# EAGLE design cpu (EAGLE 6.4)
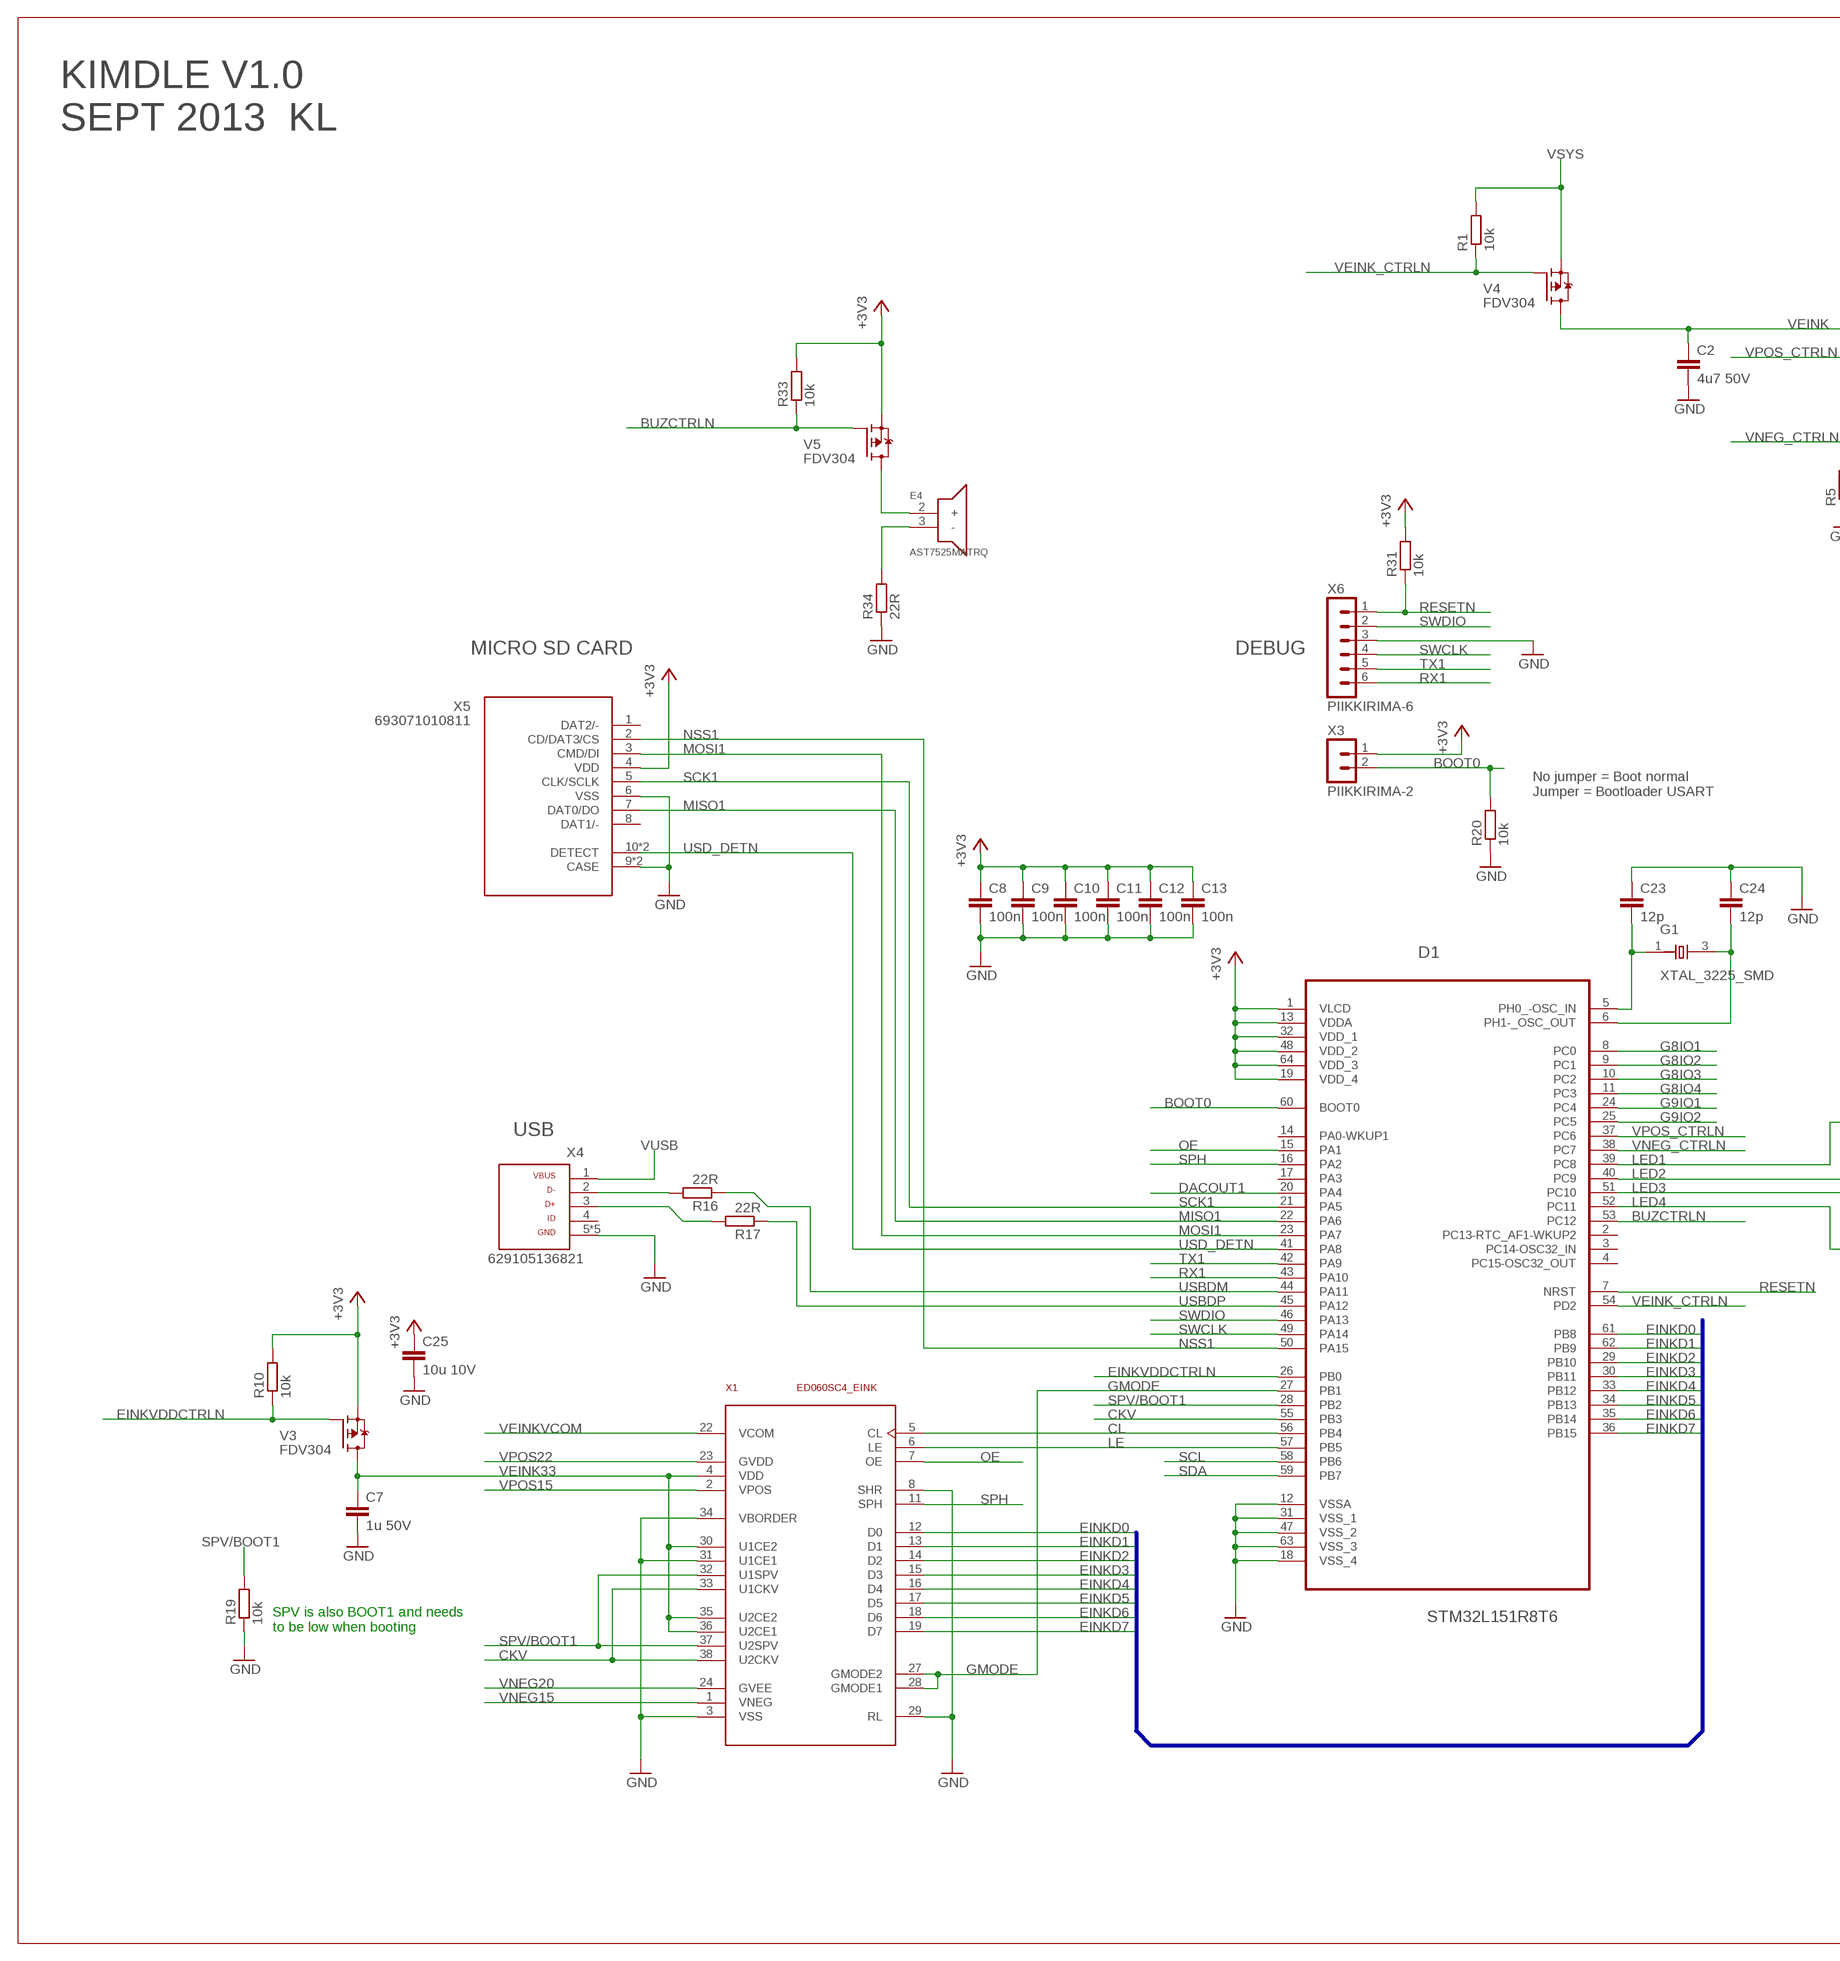
[diagram p0: schematic, sheet 1, part 1 of 2]
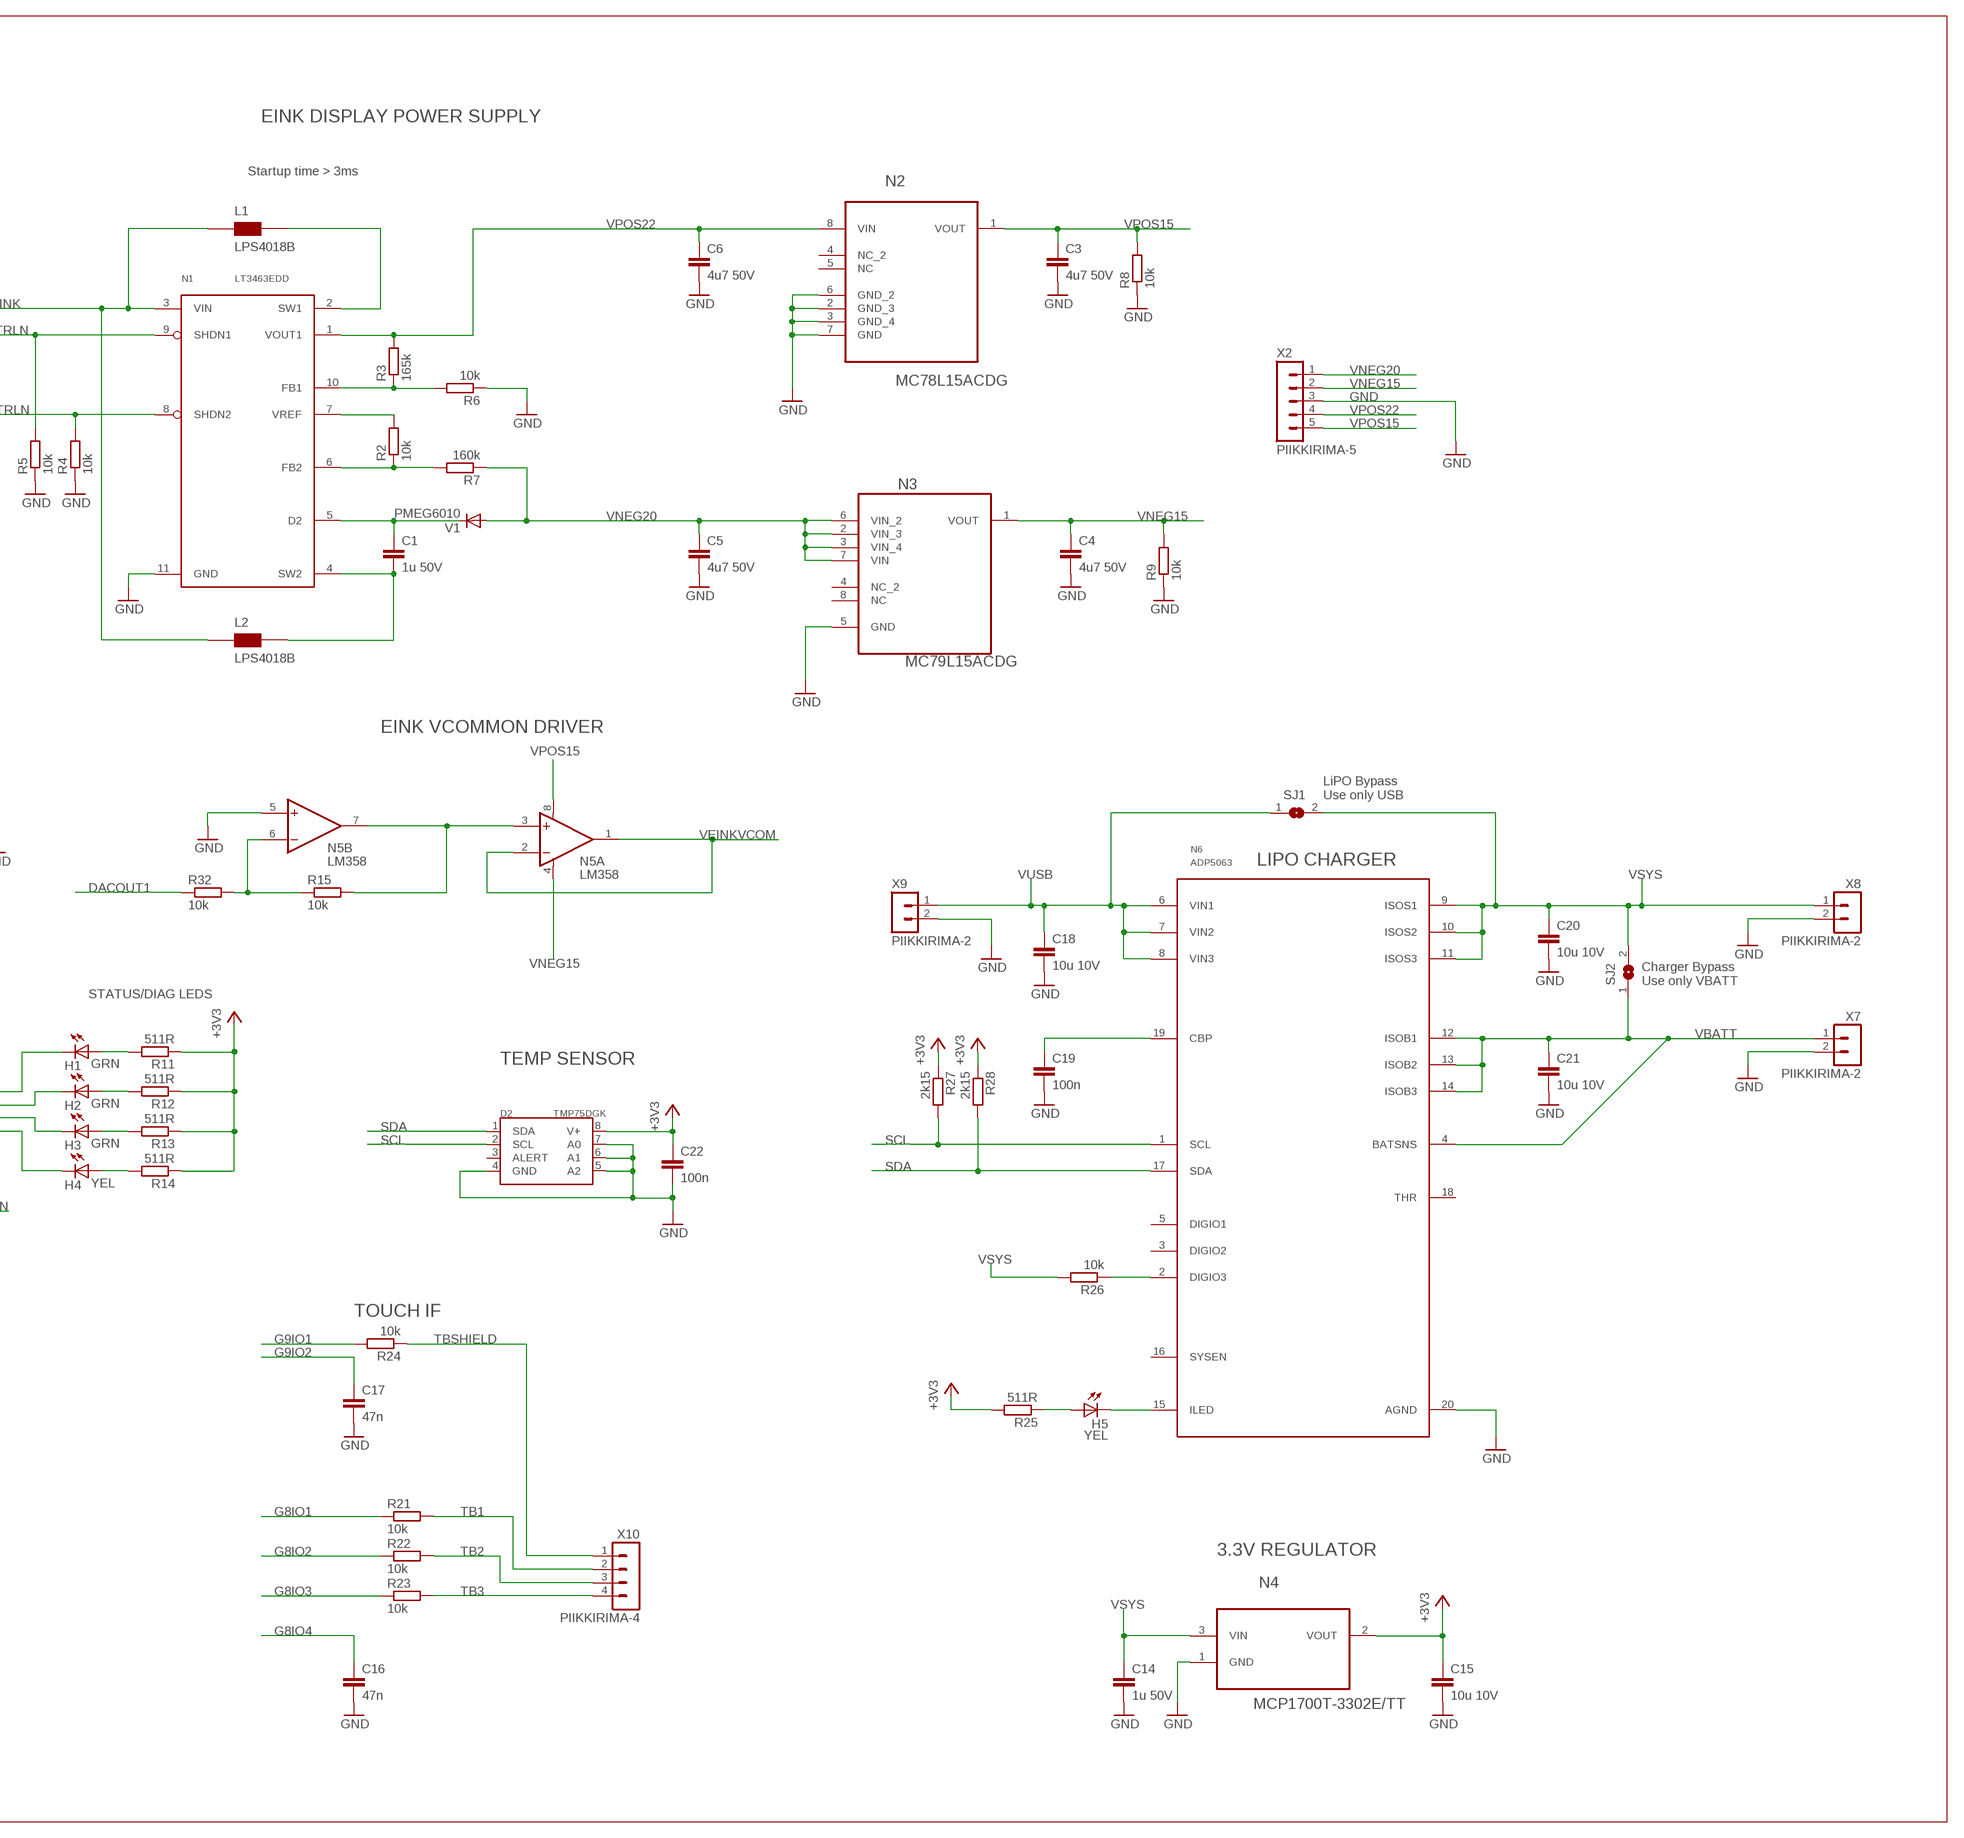
[diagram p1: schematic, sheet 1, part 2 of 2]

## Parts
C1  1u 50V  C-EUC0805  [C0805]
C2  4u7 50V  C-EUC0805  [C0805]
C3  4u7 50V  C-EUC0805  [C0805]
C4  4u7 50V  C-EUC0805  [C0805]
C5  4u7 50V  C-EUC0805  [C0805]
C6  4u7 50V  C-EUC0805  [C0805]
C7  1u 50V  C-EUC0805  [C0805]
C8  100n  C-EUC0603  [C0603]
C9  100n  C-EUC0603  [C0603]
C10  100n  C-EUC0603  [C0603]
C11  100n  C-EUC0603  [C0603]
C12  100n  C-EUC0603  [C0603]
C13  100n  C-EUC0603  [C0603]
C14  1u 50V  C-EUC0805  [C0805]
C15  10u 10V  C-EUC0805  [C0805]
C16  47n  C-EUC0805  [C0805]
C17  47n  C-EUC0805  [C0805]
C18  10u 10V  C-EUC0805  [C0805]
C19  100n  C-EUC0603  [C0603]
C20  10u 10V  C-EUC0805  [C0805]
C21  10u 10V  C-EUC0805  [C0805]
C22  100n  C-EUC0603  [C0603]
C23  12p  C-EUC0603  [C0603]
C24  12p  C-EUC0603  [C0603]
C25  10u 10V  C-EUC0805  [C0805]
D1  STM32L151R8T6  [QFP50P1200X1200X160-64N]
D2  TMP75DGK  [MSOP8]
E4  AST7525MATRQ  [AST7525MATRQ]
G1  XTAL_3225_SMD  [X_3225]
H1  GRN  LEDCHIP-LED0603  [CHIP-LED0603]
H2  GRN  LEDCHIP-LED0603  [CHIP-LED0603]
H3  GRN  LEDCHIP-LED0603  [CHIP-LED0603]
H4  YEL  LEDCHIP-LED0603  [CHIP-LED0603]
H5  YEL  LEDCHIP-LED0603  [CHIP-LED0603]
L1  LPS4018B  [LPS4018_V2]
L2  LPS4018B  [LPS4018_V2]
N1  LT3463EDD  [DFN300X300X80-11N]
N2  MC78L15ACDG  [SOIC127P600X175-8N]
N3  MC79L15ACDG  [SOIC127P600X175-8N]
N4  MCP1700T-3302E/TT  [SOT95P237X112-3N]
N5  LM358  MAX412CPAMSOP  [SOP65P490X110-8N]
N6  ADP5063  [QFN50P400X400X80-21N]
R1  10k  R-EU_R0603  [R0603]
R2  10k  R-EU_R0603  [R0603]
R3  165k  R-EU_R0603  [R0603]
R4  10k  R-EU_R0603  [R0603]
R5  10k  R-EU_R0603  [R0603]
R6  10k  R-EU_R0603  [R0603]
R7  160k  R-EU_R0603  [R0603]
R8  10k  R-EU_R0603  [R0603]
R9  10k  R-EU_R0603  [R0603]
R10  10k  R-EU_R0603  [R0603]
R11  511R  R-EU_R0603  [R0603]
R12  511R  R-EU_R0603  [R0603]
R13  511R  R-EU_R0603  [R0603]
R14  511R  R-EU_R0603  [R0603]
R15  10k  R-EU_R0603  [R0603]
R16  22R  R-EU_R0603  [R0603]
R17  22R  R-EU_R0603  [R0603]
R19  10k  R-EU_R0603  [R0603]
R20  10k  R-EU_R0603  [R0603]
R21  10k  R-EU_R0603  [R0603]
R22  10k  R-EU_R0603  [R0603]
R23  10k  R-EU_R0603  [R0603]
R24  10k  R-EU_R0603  [R0603]
R25  511R  R-EU_R0603  [R0603]
R26  10k  R-EU_R0603  [R0603]
R27  2k15  R-EU_R0603  [R0603]
R28  2k15  R-EU_R0603  [R0603]
R31  10k  R-EU_R0603  [R0603]
R32  10k  R-EU_R0603  [R0603]
R33  10k  R-EU_R0603  [R0603]
R34  22R  R-EU_R0603  [R0603]
SJ1  SJ  [SJ-SMALL]
SJ2  SJ  [SJ-SMALL]
V1  PMEG6010  DIODE-SOD323-R  [SOD323-R]
V3  FDV304  DMG2307LSOT23  [SOT23]
V4  FDV304  DMG2307LSOT23  [SOT23]
V5  FDV304  DMG2307LSOT23  [SOT23]
X1  ED060SC4_EINK  [FH26-39S-0.3SHW]
X2  PIIKKIRIMA-5  [PIIKKIRIMA-5]
X3  PIIKKIRIMA-2  [PIIKKIRIMA-2]
X4  629105136821  [629105136821]
X5  693071010811  [693071010811]
X6  PIIKKIRIMA-6  [PIIKKIRIMA-6]
X7  PIIKKIRIMA-2  [PIIKKIRIMA-2]
X8  PIIKKIRIMA-2  [PIIKKIRIMA-2]
X9  PIIKKIRIMA-2  [PIIKKIRIMA-2]
X10  PIIKKIRIMA-4  [PIIKKIRIMA-4]

## Nets
+3V3: C8.1 C9.1 C10.1 C11.1 C12.1 C13.1 C15.1 C22.1 C25.1 D1.1(VLCD) D1.13(VDDA) D1.19(VDD_4) D1.32(VDD_1) D1.48(VDD_2) D1.64(VDD_3) D2.8(V+) N4.2(VOUT) R10.2 R11.1 R12.1 R13.1 R14.1 R25.2 R27.1 R28.1 R31.2 R33.2 V3.2(S) V5.2(S) X3.1 X5.4(VDD)
BOOT0: D1.60(BOOT0) R20.2 X3.2
BUZCTRLN: D1.53(PC12) R33.1 V5.1(G)
CKV: D1.55(PB3) X1.33(U1CKV) X1.38(U2CKV)
CL: D1.56(PB4) X1.5(CL)
DACOUT1: D1.20(PA4) R32.1
EINKD0: D1.61(PB8) X1.12(D0)
EINKD1: D1.62(PB9) X1.13(D1)
EINKD2: D1.29(PB10) X1.14(D2)
EINKD3: D1.30(PB11) X1.15(D3)
EINKD4: D1.33(PB12) X1.16(D4)
EINKD5: D1.34(PB13) X1.17(D5)
EINKD6: D1.35(PB14) X1.18(D6)
EINKD7: D1.36(PB15) X1.19(D7)
EINKVDDCTRLN: D1.26(PB0) R10.1 V3.1(G)
G8IO1: D1.8(PC0) R21.1
G8IO2: D1.9(PC1) R22.1
G8IO3: D1.10(PC2) R23.1
G8IO4: C16.1 D1.11(PC3)
G9IO1: D1.24(PC4) R24.2
G9IO2: C17.1 D1.25(PC5)
GMODE: D1.27(PB1) X1.27(GMODE2) X1.28(GMODE1)
GND: C2.2 C3.2 C4.2 C5.2 C6.2 C7.2 C8.2 C9.2 C10.2 C11.2 C12.2 C13.2 C14.2 C15.2 C16.2 C17.2 C18.2 C19.2 C20.2 C21.2 C22.2 C23.1 C24.1 C25.2 D1.12(VSSA) D1.18(VSS_4) D1.31(VSS_1) D1.47(VSS_2) D1.63(VSS_3) D2.4(GND) D2.5(A2) D2.6(A1) D2.7(A0) N1.11(GND) N2.2(GND_3) N2.3(GND_4) N2.6(GND_2) N2.7(GND) N3.5(GND) N4.1(GND) N5.5(B:+IN) N6.20(AGND) R4.1 R5.1 R6.1 R8.1 R9.1 R19.1 R20.1 R34.1 X1.3(VSS) X1.8(SHR) X1.29(RL) X1.31(U1CE1) X1.34(VBORDER) X2.3 X4.5 X4.Z1 X4.Z2 X4.Z3 X4.Z4 X5.6(VSS) X5.9(CASE) X5.9B(CASE) X6.3 X7.2 X8.2 X9.2
LE: D1.57(PB5) X1.6(LE)
LED1: D1.39(PC8) H1.C
LED2: D1.40(PC9) H2.C
LED3: D1.51(PC10) H3.C
LED4: D1.52(PC11) H4.C
MISO1: D1.22(PA6) X5.7(DAT0/DO)
MOSI1: D1.23(PA7) X5.3(CMD/DI)
N$1: C1.1 N1.5(D2) V1.C
N$2: R17.2 X4.3
N$3: N1.6(FB2) R2.1 R7.2
N$4: R16.2 X4.2
N$5: E4.3(-) R34.2
N$6: L1.2(B) N1.2(SW1)
N$7: C1.2 L2.2(B) N1.4(SW2)
N$8: N5.3(A:+IN) N5.7(B:OUT) R15.2
N$9: N1.7(VREF) R2.2
N$10: H1.A R11.2
N$11: N1.10(FB1) R3.1 R6.2
N$12: C23.2 D1.5(PH0_-OSC_IN) G1.1(X1)
N$13: H2.A R12.2
N$14: C24.2 D1.6(PH1-_OSC_OUT) G1.3(X2)
N$15: H3.A R13.2
N$17: H4.A R14.2
N$18: N5.6(B:-IN) R15.1 R32.2
N$20: H5.C N6.15(ILED)
N$21: C19.1 N6.19(CBP)
N$22: H5.A R25.1
N$24: N6.2(DIGIO3) R26.1
NSS1: D1.50(PA15) X5.2(CD/DAT3/CS)
OE: D1.15(PA1) X1.7(OE)
RESETN: D1.7(NRST) R31.1 X6.1
RX1: D1.43(PA10) X6.6
SCK1: D1.21(PA5) X5.5(CLK/SCLK)
SCL: D1.58(PB6) D2.2(SCL) N6.1(SCL) R27.2
SDA: D1.59(PB7) D2.1(SDA) N6.17(SDA) R28.2
SPH: D1.16(PA2) X1.11(SPH)
SPV/BOOT1: D1.28(PB2) R19.2 X1.32(U1SPV) X1.37(U2SPV)
SWCLK: D1.49(PA14) X6.4
SWDIO: D1.46(PA13) X6.2
TB1: R21.2 X10.2
TB2: R22.2 X10.3
TB3: R23.2 X10.4
TBSHIELD: R24.1 X10.1
TX1: D1.42(PA9) X6.5
USBDM: D1.44(PA11) R16.1
USBDP: D1.45(PA12) R17.1
USD_DETN: D1.41(PA8) X5.10(DETECT) X5.10B(DETECT)
VBATT: C21.1 N6.4(BATSNS) N6.12(ISOB1) N6.13(ISOB2) N6.14(ISOB3) SJ2.1 X7.1
VEINK: C2.1 L1.1(A) L2.1(A) N1.3(VIN) V4.3(D)
VEINK1: E4.2(+) V5.3(D)
VEINK33: C7.1 V3.3(D) X1.4(VDD) X1.30(U1CE2) X1.35(U2CE2) X1.36(U2CE1)
VEINK_CTRLN: D1.54(PD2) R1.1 V4.1(G)
VEINKVCOM: N5.1(A:OUT) N5.2(A:-IN) X1.22(VCOM)
VNEG15: C4.1 N3.1(VOUT) N5.4(A:V-) R9.2 X1.1(VNEG) X2.2
VNEG20: C5.1 N3.2(VIN_3) N3.3(VIN_4) N3.6(VIN_2) N3.7(VIN) R7.1 V1.A X1.24(GVEE) X2.1
VNEG_CTRLN: D1.38(PC7) N1.8(SHDN2) R4.2
VPOS15: C3.1 N2.1(VOUT) N5.8(A:V+) R8.2 X1.2(VPOS) X2.5
VPOS22: C6.1 N1.1(VOUT1) N2.8(VIN) R3.2 X1.23(GVDD) X2.4
VPOS_CTRLN: D1.37(PC6) N1.9(SHDN1) R5.2
VSYS: C14.1 C20.1 N4.3(VIN) N6.9(ISOS1) N6.10(ISOS2) N6.11(ISOS3) R1.2 R26.2 SJ1.2 SJ2.2 V4.2(S) X8.1
VUSB: C18.1 N6.6(VIN1) N6.7(VIN2) N6.8(VIN3) SJ1.1 X4.1 X9.1
Unconnected: D1.2(PC13-RTC_AF1-WKUP2) D1.3(PC14-OSC32_IN) D1.4(PC15-OSC32_OUT) D1.14(PA0-WKUP1) D1.17(PA3) D2.3(ALERT) N2.4(NC_2) N2.5(NC) N3.4(NC_2) N3.8(NC) N6.3(DIGIO2) N6.5(DIGIO1) N6.16(SYSEN) N6.18(THR) X4.4 X5.1(DAT2/-) X5.8(DAT1/-)

## Buses
EINKD[0..7]

## Notes on the sheet
- KIMDLE V1.0
  SEPT 2013  KL
- EINK DISPLAY POWER SUPPLY
- Startup time > 3ms
- MICRO SD CARD | DEBUG
- EINK VCOMMON DRIVER
- No jumper = Boot normal
  Jumper = Bootloader USART
- LiPO Bypass
  Use only USB
- LIPO CHARGER
- Charger Bypass
  Use only VBATT
- STATUS/DIAG LEDS
- USB | TEMP SENSOR
- TOUCH IF
- SPV is also BOOT1 and needs
  to be low when booting
- 3.3V REGULATOR

## Library data of the parts
C1-C25 = rcl:C-EU: CAPACITOR, European symbol
D1 = ST Microelctronics_By_element14_Batch_1:STM32L151R8T6: Ultralow power ARM-based 32-bit MCU; MPN: STM32L151R8T6; OC_FARNELL: 2060931; OC_NEWARK: 65T3796; PACKAGE: QTP-64; SUPPLIER: STMICROELECTRONICS
D2 = ti_tmp:TMP75
E4 = OMAT_IC:AST7525MATRQ
G1 = OMAT_IC:XTAL_3225_SMD: CRYSTAL CLOCK OSCILLATORS 5.0 Vdc or 3.3 Vdc - LOW PROFILE ULTRA MINIATURE CERAMIC SURFACE MOUNT Source: http://www.abracon.com/Oscillators/asf1-L-L1.pdf
H1-H5 = OMAT_IC:LED: LED OSRAM: - CHIPLED LG R971, LG N971, LY N971, LG Q971, LY Q971, LO R971, LY R971 LH N974, LH R974 LS Q976, LO Q976, LY Q976 LO Q996 - Hyper CHIPLED LW Q18S LB Q993, LB Q99A, LB R99A - SideLED LS A670, LO A670, LY A670, LG A670, LP A670 LB A673, LV A673, LT A673, LW A673 LH A674 LY A675 LS A676, LA A676, LO A676, LY A676, LW A676 LS A679, LY A679, LG A679 - Hyper Micro SIDELED® LS Y876, LA Y876, LO Y876, LY Y876 LT Y87S - SmartLED LW L88C, LW L88S LB L89C, LB L89S, LG L890 LS L89K, LO L89K, LY L89K LS L896, LA L896, LO L896, LY L896 - TOPLED LS T670, LO T670, LY T670, LG T670, LP T670 LSG T670, LSP T670, LSY T670, LOP T670, LYG T670 LG T671, LOG T671, LSG T671 LB T673, LV T673, LT T673, LW T673 LH T674 LS T676, LA T676, LO T676, LY T676, LB T676, LH T676, LSB T676, LW T676 LB T67C, LV T67C, LT T67C, LS T67K, LO T67K, LY T67K, LW E67C LS E67B, LA E67B, LO E67B, LY E67B, LB E67C, LV E67C, LT E67C LW T67C LS T679, LY T679, LG T679 LS T770, LO T770, LY T770, LG T770, LP T770 LB T773, LV T773, LT T773, LW T773 LH T774 LS E675, LA E675, LY E675, LS T675 LS T776, LA T776, LO T776, LY T776, LB T776 LHGB T686 LT T68C, LB T68C - Hyper Mini TOPLED® LB M676 - Mini TOPLED Santana® LG M470 LS M47K, LO M47K, LY M47K Source: http://www.osram.convergy.de LUXEON: - LUMILED® LXK2-PW12-R00, LXK2-PW12-S00, LXK2-PW14-U00, LXK2-PW14-V00 LXK2-PM12-R00, LXK2-PM12-S00, LXK2-PM14-U00 LXK2-PE12-Q00, LXK2-PE12-R00, LXK2-PE12-S00, LXK2-PE14-T00, LXK2-PE14-U00 LXK2-PB12-K00, LXK2-PB12-L00, LXK2-PB12-M00, LXK2-PB14-N00, LXK2-PB14-P00, LXK2-PB14-Q00 LXK2-PR12-L00, LXK2-PR12-M00, LXK2-PR14-Q00, LXK2-PR14-R00 LXK2-PD12-Q00, LXK2-PD12-R00, LXK2-PD12-S00 LXK2-PH12-R00, LXK2-PH12-S00 LXK2-PL12-P00, LXK2-PL12-Q00, LXK2-PL12-R00 Source: www.luxeon.com KINGBRIGHT: KA-3528ASYC Source: www.kingbright.com
L1 L2 = OMAT_IC:LPS4018: Coilcraft Shielded SMT power inductor 15uH inductor for LM2842 switching regulator application circuit.
N1 = OMAT_IC:LT3463
N2 = ON Semiconductor_By_element14_Batch_1:MC78L15ACDG: Positive Linear Voltage Regulator; MPN: MC78L15ACDG; OC_FARNELL: 1211121; OC_NEWARK: 71J5721; PACKAGE: 8-SOIC; SUPPLIER: ON Semi
N3 = ON Semiconductor_By_element14_Batch_1:MC79L15ACDG: Negative Linear Voltage Regulator; MPN: MC79L15ACDG; OC_FARNELL: 1211126; OC_NEWARK: 26K4415; PACKAGE: 8-SOIC; SUPPLIER: ON Semi
N4 = Microchip_By_element14_Batch_1:MCP1700T-3302E/TT: Low Quiescent Current LDO; MPN: MCP1700T-3302E/TT; OC_FARNELL: 1296592; OC_NEWARK: 88H9817; PACKAGE: SOT23-3; SUPPLIER: Microchip
N5 = OMAT_IC:MAX412CPA: OP AMP
N6 = OMAT_IC:ADP5063
R1-R17 R19-R28 R31-R34 = rcl:R-EU_: RESISTOR, European symbol
SJ1 SJ2 = OMAT_IC:SJ: SMD solder JUMPER
V1 = diode:DIODE-: DIODE
V3-V5 = OMAT_IC:DMG2307L: OptiMOS(R)-P Small-Signal-Transistor P-Channel, Enhancement mode, Super Logic Level (2.5 V rated) Source: http://www.infineon.com/upload/Document/BSA223SP_Rev1.3.pdf
X1 = hirose-flex:ED060SC4_EINK
X2 = OMAT_IC:PIIKKIRIMA-5
X3 X7-X9 = OMAT_IC:PIIKKIRIMA-2
X4 = OMAT_IC:629105136821: WR-COM SMT Horizontal 5 Contacts Micro USB Type B,5 pins
X5 = OMAT_IC:693071010811: WR-CRD MICRO SD CARD CONNECTOR PUSH & PUSH WITH CARD DETECTION 8PINS
X6 = OMAT_IC:PIIKKIRIMA-6
X10 = OMAT_IC:PIIKKIRIMA-4

## Board
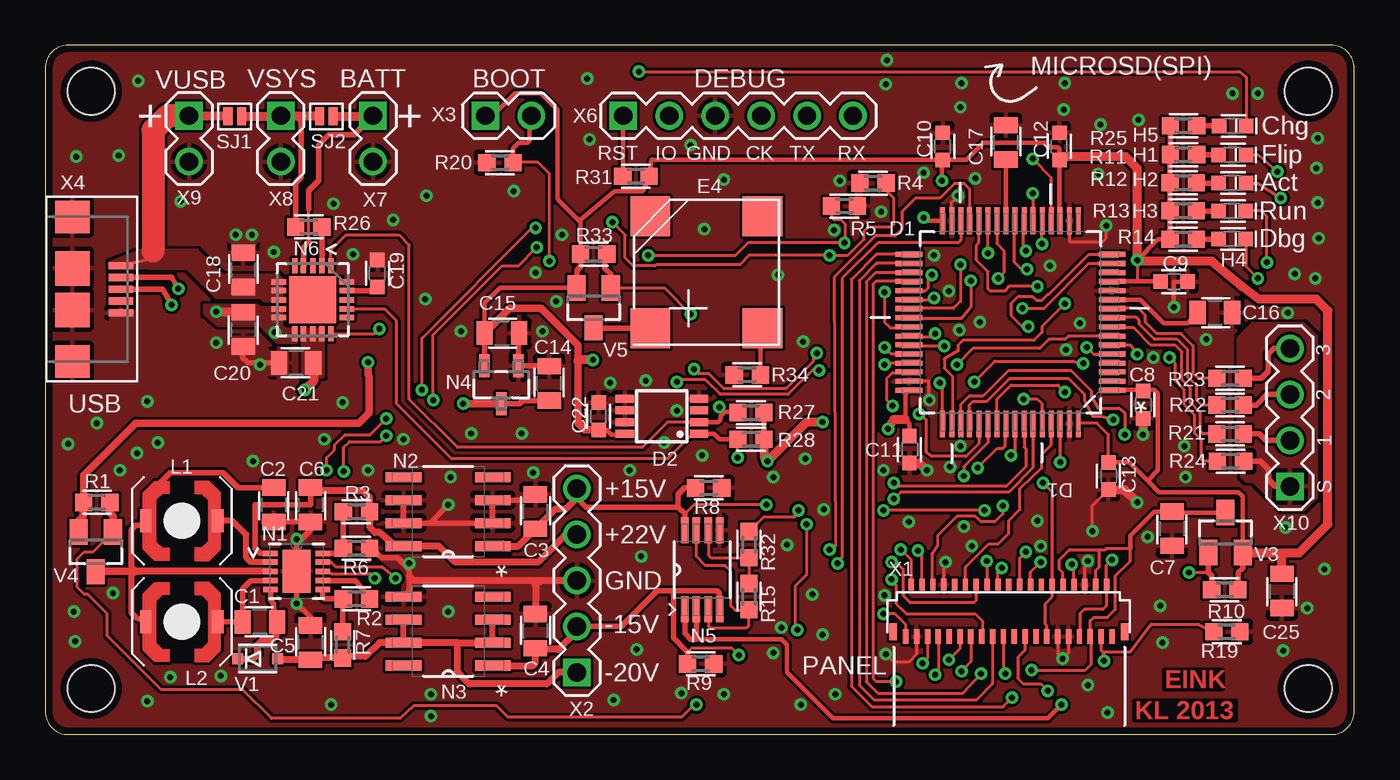
[diagram p2: board, top side]
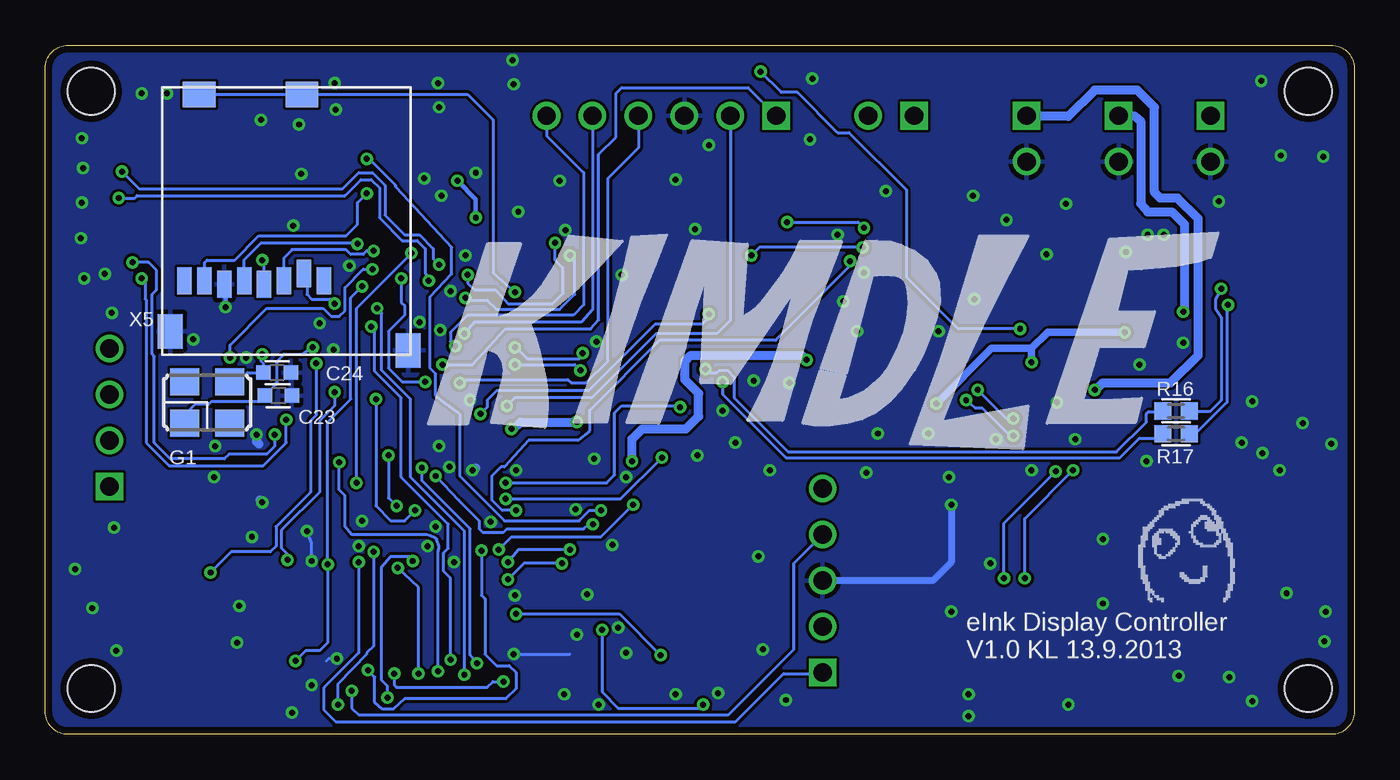
[diagram p3: board, bottom side, seen from below]

Size 72.39 x 38.1 mm. Coordinates in mm from the lower left corner, seen from the top.
Outline: 0,36.83 0,1.27 arc90 1.27,0 71.12,0 arc90 72.39,1.27 72.39,36.83 arc90 71.12,38.1 1.27,38.1 arc90 0,36.83
Copper layers (1*16): Top 0.0356mm / dielectric 1.5011mm / Bottom 0.0356mm
Design rules "LaenPCBOrder": minimum track width 6mil, minimum drill 13mil, track to track 6mil, track to pad 6mil, pad to pad 6mil, via to via 6mil, smd to smd 6mil, copper to edge 15mil, drill to drill 6mil, minimum pad ring 7mil, minimum via ring 7mil, stop-mask expansion 4mil, vias tented up to drill 0mil, thermal gap 10mil
Holes 2.6 mm at 2.54,35.56 69.85,2.54 69.85,35.56 2.54,2.54

### Footprints (pad centres in the part's own frame; a part is rotated, then mirrored left to right if it is on the bottom)
C0805 = smd 0.9 x 1.3: 1 -0.95,0; 2 0.95,0
C0603 = smd 0.8 x 0.8: 1 -0.75,0; 2 0.75,0
QFP50P1200X1200X160-64N = smd 1.473 x 0.279: 1 -5.613,3.759; 2 -5.613,3.251; 3 -5.613,2.743; 4 -5.613,2.261; 5 -5.613,1.753; 6 -5.613,1.245; 7 -5.613,0.762; 8 -5.613,0.254; 9 -5.613,-0.254; 10 -5.613,-0.762; 11 -5.613,-1.245; 12 -5.613,-1.753; 13 -5.613,-2.261; 14 -5.613,-2.743; 15 -5.613,-3.251; 16 -5.613,-3.759; 33 5.613,-3.759; 34 5.613,-3.251; 35 5.613,-2.743; 36 5.613,-2.261; 37 5.613,-1.753; 38 5.613,-1.245; 39 5.613,-0.762; 40 5.613,-0.254; 41 5.613,0.254; 42 5.613,0.762; 43 5.613,1.245; 44 5.613,1.753; 45 5.613,2.261; 46 5.613,2.743; 47 5.613,3.251; 48 5.613,3.759 | smd 0.279 x 1.473: 17 -3.759,-5.613; 18 -3.251,-5.613; 19 -2.743,-5.613; 20 -2.261,-5.613; 21 -1.753,-5.613; 22 -1.245,-5.613; 23 -0.762,-5.613; 24 -0.254,-5.613; 25 0.254,-5.613; 26 0.762,-5.613; 27 1.245,-5.613; 28 1.753,-5.613; 29 2.261,-5.613; 30 2.743,-5.613; 31 3.251,-5.613; 32 3.759,-5.613; 49 3.759,5.613; 50 3.251,5.613; 51 2.743,5.613; 52 2.261,5.613; 53 1.753,5.613; 54 1.245,5.613; 55 0.762,5.613; 56 0.254,5.613; 57 -0.254,5.613; 58 -0.762,5.613; 59 -1.245,5.613; 60 -1.753,5.613; 61 -2.261,5.613; 62 -2.743,5.613; 63 -3.251,5.613; 64 -3.759,5.613
MSOP8 = smd 0.45 x 1: 1 -0.975,-2.05; 2 -0.325,-2.05; 3 0.325,-2.05; 4 0.975,-2.05; 5 0.975,2.05; 6 0.325,2.05; 7 -0.325,2.05; 8 -0.975,2.05
AST7525MATRQ = smd 2.2 x 2.2: 1 -3.1,3.1; 2 -3.1,-3.1; 3 3.1,-3.1; 4 3.1,3.1
X_3225 = smd 1.6 x 1.5: 1 -1.25,-1.15; 2 1.25,-1.15; 3 1.25,1.15; 4 -1.25,1.15
CHIP-LED0603 = smd 0.8 x 0.8: A -0.75,0; C 0.75,0
LPS4018_V2 = smd 0.635 x 1.27: 1 -2,0; 2 2,0
DFN300X300X80-11N = smd 0.813 x 0.305: 1 -1.448,0.991; 2 -1.448,0.508; 3 -1.448,0; 4 -1.448,-0.508; 5 -1.448,-0.991; 6 1.448,-0.991; 7 1.448,-0.508; 8 1.448,0; 9 1.448,0.508; 10 1.448,0.991 | smd 1.549 x 2.388: 11 0,0
SOIC127P600X175-8N = smd 1.981 x 0.559: 1 -2.464,1.905; 2 -2.464,0.635; 3 -2.464,-0.635; 4 -2.464,-1.905; 5 2.464,-1.905; 6 2.464,-0.635; 7 2.464,0.635; 8 2.464,1.905
SOT95P237X112-3N = smd 0.559 x 1.27: 1 -0.94,-1.041; 2 0.94,-1.041; 3 0,1.041
SOP65P490X110-8N = smd 1.422 x 0.432: 1 -2.184,0.965; 2 -2.184,0.33; 3 -2.184,-0.33; 4 -2.184,-0.965; 5 2.184,-0.965; 6 2.184,-0.33; 7 2.184,0.33; 8 2.184,0.965
QFN50P400X400X80-21N = smd 0.813 x 0.305: 1 -1.88,0.991; 2 -1.88,0.508; 3 -1.88,0; 4 -1.88,-0.508; 5 -1.88,-0.991; 11 1.88,-0.991; 12 1.88,-0.508; 13 1.88,0; 14 1.88,0.508; 15 1.88,0.991 | smd 0.305 x 0.813: 6 -0.991,-1.88; 7 -0.508,-1.88; 8 0,-1.88; 9 0.508,-1.88; 10 0.991,-1.88; 16 0.991,1.88; 17 0.508,1.88; 18 0,1.88; 19 -0.508,1.88; 20 -0.991,1.88 | smd 2.591 x 2.591: 21 0,0
R0603 = smd 0.95 x 0.95: 1 -0.725,0; 2 0.725,0
SJ-SMALL = smd 0.5 x 1: 1 -0.375,0; 2 0.375,0
SOD323-R = smd 0.6 x 0.6: A 1.1,0; C -1.1,0
SOT23 = smd 1 x 1.4: 1 -0.95,-1.1; 2 0.95,-1.1; 3 0,1.1
FH26-39S-0.3SHW = smd 0.3 x 0.8: 1 0,0; 3 0.6,0; 5 1.2,0; 7 1.8,0; 9 2.4,0; 11 3,0; 13 3.6,0; 15 4.2,0; 17 4.8,0; 19 5.4,0; 21 6,0; 23 6.6,0; 25 7.2,0; 27 7.8,0; 29 8.4,0; 31 9,0; 33 9.6,0; 35 10.2,0; 37 10.8,0; 39 11.4,0 | smd 0.3 x 0.65: 2 0.3,2.875; 4 0.9,2.875; 6 1.5,2.875; 8 2.1,2.875; 10 2.7,2.875; 12 3.3,2.875; 14 3.9,2.875; 16 4.5,2.875; 18 5.1,2.875; 20 5.7,2.875; 22 6.3,2.875; 24 6.9,2.875; 26 7.5,2.875; 28 8.1,2.875; 30 8.7,2.875; 32 9.3,2.875; 34 9.9,2.875; 36 10.5,2.875; 38 11.1,2.875 | smd 0.4 x 0.95: P1 -0.7,0.275; P2 12.1,0.275
PIIKKIRIMA-5 = drill 1.016 square: 1 0,0 | drill 1.016: 2 2.54,0; 3 5.08,0; 4 7.62,0; 5 10.16,0
PIIKKIRIMA-2 = drill 1.016 square: 1 0,0 | drill 1.016: 2 2.54,0
629105136821 = smd 0.4 x 1.35: 1 -1.3,0; 2 -0.65,0; 3 0,0; 4 0.65,0; 5 1.3,0 | smd 1.8 x 1.9: Z1 -4,-2.675; Z4 4,-2.675 | smd 1.9 x 1.9: Z2 -1.15,-2.675; Z3 1.15,-2.675
693071010811 = smd 0.8 x 1.5: 1 0,0; 2 1.1,-0.4; 3 2.2,0; 4 3.3,0.2; 5 4.4,0; 6 5.5,0.2; 7 6.6,0; 8 7.7,0 | smd 1.4 x 1.9: 9 -4.66,3.85; 9B 8.49,2.8 | smd 1.8 x 1.4: 10 1.2,-10.3; 10B 6.89,-10.3
PIIKKIRIMA-6 = drill 1.016 square: 1 0,0 | drill 1.016: 2 2.54,0; 3 5.08,0; 4 7.62,0; 5 10.16,0; 6 12.7,0
PIIKKIRIMA-4 = drill 1.016 square: 1 0,0 | drill 1.016: 2 2.54,0; 3 5.08,0; 4 7.62,0

### Placement (x,y rotation side)
C1  11.87,6.22 180 top
C2  12.64,12.7 270 top
C3  27.11,12.32 90 top
C4  27.11,5.71 90 top
C5  14.67,5.08 90 top
C6  14.67,12.7 270 top
C7  62.31,11.38 270 top
C8  60.71,18.22 270 top
C9  62.42,25.03 0 top
C10  49.63,32.51 90 top
C11  47.79,15.75 270 top
C12  56.08,32.51 90 top
C13  58.8,14.29 270 top
C14  27.86,19.41 90 top
C15  25.25,22.19 0 top
C16  64.68,23.32 0 top
C17  53.12,32.73 90 top
C18  10.96,25.68 90 top
C19  18.38,25.49 90 top
C20  10.95,22.39 270 top
C21  13.88,20.54 180 top
C22  30.61,17.59 90 top
C23  59.5,18.73 180 bottom
C24  59.56,20 180 bottom
C25  68.39,7.94 270 top
D1  53.38,22.78 180 top
D2  34.1,17.59 90 top
E4  36.56,25.55 0 top
G1  63.44,18.35 0 bottom
H1  65.65,32.04 0 top
H2  65.65,30.48 0 top
H3  65.63,28.93 0 top
H4  65.63,27.38 0 top
H5  65.66,33.64 0 top
L1  7.56,11.81 0 top
L2  7.56,6.22 0 top
N1  13.91,9.02 0 top
N2  22.29,12.32 180 top
N3  22.29,5.71 180 top
N4  25.22,19.33 180 top
N5  36.33,9.11 90 top
N6  14.8,24.03 270 top
R1  2.86,12.83 180 top
R2  17.21,7.49 0 top
R3  17.21,12.32 0 top
R4  45.78,30.48 0 top
R5  44.2,29.21 180 top
R6  17.21,10.29 180 top
R7  16.45,4.95 90 top
R8  36.69,13.63 180 top
R9  36.25,3.9 180 top
R10  65.23,8 0 top
R11  62.94,32.05 0 top
R12  62.93,30.51 0 top
R13  62.93,28.94 0 top
R14  62.93,27.37 0 top
R15  38.93,7.62 270 top
R16  9.86,17.88 0 bottom
R17  9.86,16.62 0 bottom
R19  65.34,5.68 180 top
R20  25.15,31.61 0 top
R21  65.52,16.61 0 top
R22  65.52,18.21 0 top
R23  65.52,19.68 0 top
R24  65.54,15.1 180 top
R25  62.94,33.66 180 top
R26  14.58,28.05 180 top
R27  39.03,17.79 180 top
R28  39.03,16.32 180 top
R31  32.66,30.86 0 top
R32  38.93,10.49 270 top
R33  30.33,26.56 180 top
R34  38.82,19.88 0 top
SJ1  10.48,34.16 0 top
SJ2  15.56,34.16 180 top
U$3  [DAFUG]  9.08,9.91 0 bottom
V1  11.75,4.19 0 top
V3  65.27,11.16 0 top
V4  2.79,10.1 180 top
V5  30.33,23.58 180 top
X1  47.59,5.41 0 top
X2  29.4,3.43 90 top
X3  24.35,34.2 0 top
X4  4.18,24.61 270 top
X5  56.98,25.08 180 bottom
X6  31.97,34.2 0 top
X7  18.12,34.2 270 top
X8  13.03,34.2 270 top
X9  7.95,34.2 270 top
X10  68.83,13.72 90 top

### Tracks (layer width: path | path; a pad name or v marks a point on that pad's centre or on a via)
+3V3  (via drill 0.33)
  Top 0.152: C13.1 58.8,16.57 58.17,17.21 57.17,17.21 D1.64 | 59.02,19.05 D1.1 | v60.39,26.23 60.39,26.16 60.39,25.04 | 56.13,31.81 C12.1
  Top 0.254: D1.13 60.39,25.04 61.66,25.04 C9.1 | 59.02,19.05 60.63,19.05 | 60.63,19.05 C8.1 | C10.1 50.94,31.76 51.88,32.7 55.31,32.7 55.56,32.45 56.01,32.45 56.07,32.38 C12.1 56.08,28.43 D1.19 | V3.2 66.22,13.16 65.98,13.4 61.59,13.4 60.96,14.03 | 60.96,14.03 59.94,15.05 58.81,15.05 C13.1 | 60.63,19.05 61.34,19.05 61.53,18.86 61.53,14.61 60.96,14.03 | R14.1 61.53,27.37 v60.39,26.23 | 29.59,28.32 29.59,28.45 31.5,30.04 33.02,30.04 33.39,30.72 R31.2 33.53,31.76 C10.1 | 29.59,28.32 R33.2 | C15.1 24.3,23.85 25.15,24.7 29.36,24.7 V5.2 | C22.1 31.04,16.84 31.3,16.57 32.01,16.57 D2.8 | X3.1 24.74,34.2 25.97,35.43 27.43,35.43 28.32,34.54 28.32,29.59 29.59,28.32 | C11.1 47.79,17.17 47.56,17.4 47.56,18.82 D1.48 | D1.32 48.76,28.4 v48.58,28.57 | v49.59,30.61 49.59,31.72 C10.1
  Top 0.305: R33.2 29.6,25.86 29.4,25.65 29.4,24.71 V5.2 | C15.1 24.3,20.39 N4.2 | R14.1 R13.1 R12.1 62.2,32.04 R11.1 R25.2 | V3.2 66.22,9.19 65.98,8.95 65.98,8.03 R10.2 | R27.1 R28.1
  Top 0.406: C22.1 29.83,16.84 29.46,17.21 29.46,20.64 29.46,21.53 27.43,23.56 25.67,23.56 C15.1
  Top 0.508: v30.29,20.7 29.53,20.7 29.46,20.64 | R28.1 39.75,15.3 v39.94,15.11 42.1,17.27 v42.99,17.27 | 47.56,17.4 46.93,17.4 v46.61,16.89 | 68.39,10.03 66.23,10.03 66.22,10.05 V3.2 | 68.39,10.03 69.34,10.03 70.93,11.62 70.93,23.43 70.29,24.07 67.12,24.07 66.17,24.77 64.58,26.1 64.52,26.16 60.45,26.16 v60.39,26.23 | 60.39,26.16 60.39,31.3 59.75,31.94 56.26,31.94 56.13,31.81 | C25.1 68.39,10.03
  Bottom 0.152: X5.4 60.28,26.12 v60.39,26.23
  Bottom 0.254: v48.58,28.57 48.58,29.59 v49.59,30.61
  Bottom 0.508: v39.94,15.11 39.94,16.32 39.37,16.89 36.96,16.89 36.26,17.59 36.26,18.86 37.02,19.62 37.02,20.64 36.7,20.95 30.54,20.95 v30.29,20.7 | v46.61,16.89 46.48,16.89 46.1,17.27 v42.99,17.27
BOOT0  (via drill 0.33)
  Top 0.152: D1.60 55.13,18.27 54.86,18.54 v54.1,18.54 | v51.94,12.38 v46.35,12.38 | v27.88,26.16 27.88,30.99 27.24,31.62 25.88,31.62 R20.2
  Top 0.254: R20.2 25.87,32.41 26.16,32.7 26.67,32.7 26.8,32.83 26.8,34.11 X3.2
  Bottom 0.152: v54.1,18.54 54.1,12.64 53.28,11.81 52.51,11.81 v51.94,12.38 | v46.35,12.38 47.12,12.38 47.69,12.95 47.69,14.29 47.18,14.8 46.99,14.8 45.66,16.26 42.93,16.26 42.29,16.76 42.29,17.91 38.42,21.78 32,21.78 27.88,25.91 v27.88,26.16
BUZCTRLN  (via drill 0.33)
  Top 0.152: V5.1 34.24,24.68 v35.69,23.24 | D1.53 51.63,16.07 50.93,15.37 49.02,15.37 48.7,15.62 48.7,17.4 48.39,17.72 v48.32,17.72
  Top 0.305: V5.1 31.28,25.43 30.92,25.78 30.92,26.43 R33.1
  Bottom 0.152: v35.69,23.24 35.69,23.05 36.07,22.67 38.67,22.67 42.35,18.99 47.43,18.99 47.94,18.48 47.94,18.1 v48.32,17.72
CKV  (via drill 0.33)
  Top 0.152: X1.33 57.21,5.44 57.21,6.67 57.47,6.92 58.48,6.92 58.69,7.12 X1.38 58.69,9.35 v58.99,9.65 | D1.55 52.62,18.52 53.4,19.3 56.01,19.3 v56.39,18.92
  Bottom 0.152: v58.99,9.65 58.99,9.97 59.31,10.29 59.31,11.3 57.21,13.4 57.21,17.34 56.39,18.16 v56.39,18.92
CL  (via drill 0.33)
  Top 0.152: X1.5 48.79,4.21 v48.51,3.94 | v51.56,14.73 52.64,15.81 52.96,15.81 53.09,15.94 53.09,17.13 D1.56
  Bottom 0.152: v48.51,3.94 48.51,4 48.9,4.38 48.9,11.37 51.56,14.03 v51.56,14.73
DACOUT1  (via drill 0.33)
  Top 0.152: D1.20 55.64,30.79 v54.61,31.81 | v41.66,12.38 41.4,12 39.71,12 R32.1
  Bottom 0.152: v54.61,31.81 54.48,31.81 53.02,30.35 53.02,30.29 49.91,26.92 49.91,25.46 51.12,24.19 51.12,20.26 50.8,19.94 50.8,18.73 50.23,18.29 49.53,17.78 49.47,17.72 49.47,14.29 46.99,11.81 42.99,11.81 42.86,11.81 42.29,12.38 v41.66,12.38
EINKD0
  Top 0.152: X1.12 50.89,9.23 52.2,10.54 52.7,10.54 53.28,11.11 53.28,11.81 53.91,12.45 53.91,13.59 53.98,13.65 55.12,14.73 55.12,15.49 55.63,16 55.63,17.16 D1.61
EINKD1  (via drill 0.33)
  Top 0.152: X1.13 51.19,4.01 v50.67,3.49 | v56.13,15.05 56.13,17.16 D1.62
  Bottom 0.152: v50.67,3.49 50.67,10.1 50.61,10.29 50.61,10.41 50.74,10.79 50.8,10.86 51.12,10.99 51.31,11.05 55.44,11.05 55.82,11.49 55.82,13.21 56.13,13.53 v56.13,15.05
EINKD2  (via drill 0.33)
  Top 0.152: v43.37,10.22 43.69,10.41 43.62,25.27 45.91,27.56 46.99,27.56 47.37,27.94 47.37,28.89 48.13,29.65 49.47,29.65 50.29,30.48 50.8,30.48 51.12,30.16 D1.29 | v46.8,9.53 47.05,9.53 47.43,9.14 47.43,7.68 47.82,7.3 51.37,7.3 51.5,7.43 51.5,8.27 X1.14
  Bottom 0.152: v43.37,10.22 46.23,10.22 v46.8,9.53
EINKD3  (via drill 0.33)
  Top 0.152: D1.30 50.63,27.33 50.48,27.18 46.04,27.18 44.07,25.21 44.07,9.78 v43.81,9.46 | v46.8,8.57 47.05,8.26 47.05,7.24 47.62,6.67 51.44,6.67 51.82,6.29 51.82,5.44 X1.15
  Bottom 0.152: v43.81,9.46 45.91,9.46 v46.8,8.57
EINKD4  (via drill 0.33)
  Top 0.152: D1.33 45.97,26.54 44.58,25.15 44.58,2.67 45.72,1.52 52.96,1.52 v53.47,2.03 | v52.07,9.59 52.07,8.3 X1.16
  Bottom 0.152: v53.47,2.03 53.47,2.67 53.78,2.98 53.78,9.27 53.28,9.84 52.26,9.84 v52.07,9.59
EINKD5
  Top 0.152: D1.34 45.97,26.04 45.02,25.08 45.02,2.73 45.85,1.91 51.5,1.91 52.39,2.79 X1.17
EINKD6  (via drill 0.33)
  Top 0.152: D1.35 45.91,25.53 45.4,25.02 45.4,2.92 46.04,2.29 50.74,2.29 v51.75,3.37 | v52.9,9.21 52.64,8.95 52.64,8.33 X1.18
  Bottom 0.152: v51.75,3.37 51.75,8.13 v52.9,9.21
EINKD7  (via drill 0.33)
  Top 0.152: D1.36 45.94,25.04 45.78,24.89 45.78,3.11 45.97,2.92 v47.05,2.92 | X1.19 52.99,3.46 v53.09,3.37
  Bottom 0.152: v53.09,3.37 53.09,2.73 52.96,2.6 47.94,2.6 47.62,2.92 v47.05,2.92
EINKVDDCTRLN  (via drill 0.33)
  Top 0.152: D1.26 52.62,27.14 53.02,26.73 53.02,25.53 v52.7,25.21 | v51.37,19.49 52.51,20.64 56.83,20.64 v57.4,20.51 | v63.25,8.95 64.31,8.95 64.31,8.96
  Top 0.305: V3.1 64.31,8.96 64.52,8.76 64.52,8.02 R10.1
  Bottom 0.152: v52.7,25.21 52.7,23.88 52.51,23.69 52.51,23.18 53.4,22.29 53.4,20.26 52.64,19.49 v51.37,19.49 | v57.4,20.51 57.4,17.65 57.72,17.34 57.72,13.4 59.63,11.49 59.63,10.41 59.94,10.1 62.1,10.1 v63.25,8.95
G8IO1
  Top 0.152: R21.1 64.03,16.61 63.88,16.76 63.88,17.78 63.31,18.35 63.31,19.18 62.87,19.62 62.87,21.14 62.48,21.53 61.15,21.53 60.2,22.48 59.04,22.48 D1.8
G8IO2
  Top 0.152: R22.1 63.96,18.21 63.69,18.48 63.69,19.3 63.18,19.75 63.18,21.27 62.61,21.84 61.34,21.84 60.52,22.67 60.52,22.86 60.33,23.05 59,23.05 D1.9
G8IO3
  Top 0.152: R23.1 63.75,19.68 63.5,19.94 63.5,21.46 62.8,22.16 61.47,22.16 60.83,22.8 60.83,23.18 60.45,23.56 59,23.56 D1.10
G8IO4
  Top 0.254: D1.11 60.55,24.03 61.85,22.73 63.15,22.73 C16.1
G9IO1  (via drill 0.33)
  Top 0.152: R24.2 64.02,15.1 63.94,15.18 63.94,16.26 63.56,16.64 63.56,17.65 62.99,18.22 62.99,19.05 62.48,19.56 62.48,20.51 v62.17,20.83 | v54.29,25.72 53.98,25.72 53.59,26.1 53.59,28.36 D1.24
  Bottom 0.152: v62.17,20.83 62.17,21.53 60.13,23.56 57.02,23.56 56.58,23.11 56.13,23.11 55.82,23.43 55.82,24.7 54.8,25.72 v54.29,25.72
G9IO2
  Top 0.254: C17.1 D1.25
GMODE  (via drill 0.33)
  Top 0.152: v55.18,13.91 55.69,13.4 X1.28 55.69,7.62 55.31,7.24 55.31,6.1 55.39,6.02 X1.27 | v52.13,26.61 D1.27
  Bottom 0.152: v55.18,13.91 55.18,23.56 v52.13,26.61
GND  (via drill 0.33)
  Top 0.152: X1.34 57.49,9.42 v57.66,9.59 | X1.29 55.99,4.46 v56.26,4.19 56.59,4.52 X1.31 | X1.8 49.69,9.17 v49.78,9.53 | X1.3 48.19,4.43 47.75,4 46.93,4 v46.48,4.45 | v57.91,11.24 57.91,12.65 C13.2 | 50.1,28.26 50.1,29.4 v50.48,29.78 | 47.82,19.56 48.83,19.56 48.83,18.54 v48.9,18.48 | 56.64,28.38 56.64,27.24 58.48,27.24 58.67,27.43 58.67,28.07
  Top 0.254: C9.2 62.43,25.03 62.42,25.02 v62.42,23.62
  Top 0.305: C2.2 C6.2 14.67,11.3 13.91,10.54 N1.11 v13.91,7.24 14.67,6.48 C5.2 | N2.2 N2.7 21.27,11.68 v22.29,12.7 | N2.3 26.8,12.95 C3.2 | R6.1 18.1,10.29 18.61,9.78 19.49,9.78 20.13,9.14 20.13,8.76 20.13,7.92 N3.5 | C15.2 26.16,22.15 N4.1 C14.2 | C21.2 11.21,20.54 10.92,20.83 10.92,21.41 C20.2
  Top 0.33: N2.2 N2.3 | N2.7 N2.6
  Top 0.381: C4.2 27.11,8.26 27.37,8.51 X2.3 20.38,8.51 20.13,8.76 | 13.91,10.54 v13.91,10.79
  Top 0.508: C8.2 v60.71,16.57 | C13.2 59.68,13.54 v60.39,12.83 | C11.2 48.31,15 v48.77,14.61
  Bottom 0.152: v57.66,9.59 57.66,10.6 v57.91,11.24 | v56.26,4.19 56.71,4.19 56.83,4.06 | v49.78,9.53 49.91,9.72 | v46.48,4.45 43.37,4.45
  Bottom 0.254: v62.42,23.62 62.42,24.83 62.48,24.89 62.48,24.83
  Bottom 0.381: v22.29,12.7 22.29,9.53 23.3,8.51 X2.3
  Bottom 0.508: v60.71,16.57 60.71,16.19 60.58,16.07 | v60.39,12.83 60.52,12.95 | v48.77,14.61 48.58,14.73
  other vias: 15.81,1.65 10.54,27.62 11.43,27.62 9.46,21.65 11.87,20.45 17.02,26.54 34.23,16.13 49.97,24.51 69.09,25.46 64.2,21.84 50.55,22.35 51.69,22.8 50.04,14.8 50.8,11.49 54.86,11.81 55.05,10.41 32.32,14.61 31.24,19.43 51.24,10.41 42.04,15.24 40.26,14.22 43.05,12.45 41.02,10.48 5.65,18.41 2.86,17.21 1.27,16.07 1.59,6.79 1.65,5.14 6.92,3.17 9.72,3.24 22.29,6.79 21.34,2.22 32.7,4.7 31.43,1.91 15.43,16.32 11.49,15.11 17.84,14.61 19.81,16.32 16.45,18.35 6.22,16.13 5.08,15.56 4.13,14.61 21.02,24.07 19.24,28.45 21.08,29.78 15.94,29.34 12.64,26.67 7.49,29.46 1.71,31.94 5.14,36.13 46.48,35.94 43.94,30.61 37.53,30.67 35.69,32.58 30.1,32.89 25.91,30.04 60.45,33.97 58.36,33.72 56.39,36 67.06,35.43 70.23,25.21 70.42,27.43 70.36,29.4 70.29,31.31 70.36,32.96 70.74,9.14 69.79,6.99 61.79,5.08 68.45,4.64 58.74,1.21 57.66,2.73 61.66,7.11 42.99,5.52 42.42,7.75 40.26,4.51 37.53,2.22 35.18,2.29 43.69,2.22 43.62,27.88 46.23,28.89 58.67,28.13 50.67,36 50.61,34.67 56.32,34.54 23.56,16.64 26.35,16.64 26.99,14.48 22.42,14.22 33.21,19.56 34.92,17.91 36.32,15.43 32.96,9.84 63.06,14.22 62.99,15.94 65.66,35.43 41.91,21.72 55.56,25.91 40.51,25.4 61.28,20.83 57.21,22.73 56.45,21.27 51.44,30.73 58.23,30.99 68.71,23.3 68.58,11.43 50.61,15.94 49.15,26.48 46.35,14.61 60.96,10.92 36.45,27.94 5.65,1.84 21.34,1.02 47.75,11.75 46.42,7.68 40.7,5.91 41.78,1.65 46.55,37.27 29.97,36.26 28.57,27.62 27.11,25.53 28.26,23.94 27.5,22.29 22.99,22.29 3.75,7.81 20.13,9.46 4.06,32 48.58,31.05
  pour Top (no thermals): 3.56,23.5 6.29,23.5 6.79,22.99 8.7,22.99 8.89,22.8 9.84,22.03 11.62,22.03 12.45,21.21 13.4,21.21 13.46,21.15 13.46,19.81 7.87,19.81 4.89,22.8 3.56,22.86
  pour Top (no thermals): 10.35,26.16 10.35,27.05 9.97,27.43 9.97,28 10.22,28.26 11.68,28.26 12,27.94 12,27.43 11.56,26.99 11.56,26.16
  pour Top (no thermals): 16.32,24.89 17.27,24.89 17.46,25.08 17.46,25.65 17.65,25.84 19.05,25.84 19.11,25.91 19.11,26.99 19.05,27.05 16.95,27.05 16.64,26.73 16.64,25.21 16.57,25.15 16.32,25.15
  pour Top (rank 2): 71.12,0 1.27,0 arc-90 0,1.27 0,36.83 arc-90 1.27,38.1 71.12,38.1 arc-90 72.39,36.83 72.39,1.27 arc-90
  pour Bottom (rank 2): 71.12,0 1.27,0 arc-90 0,1.27 0,36.83 arc-90 1.27,38.1 71.12,38.1 arc-90 72.39,36.83 72.39,1.27 arc-90
LE  (via drill 0.33)
  Top 0.152: D1.57 53.63,15.66 v53.4,15.43 | X1.6 49.02,8.35 49.02,9.97 49.34,10.41 49.34,10.99 50.42,12.06 51.44,12.06 51.75,11.75 52.51,11.75 52.96,12.19 v52.96,12.64
  Bottom 0.152: v53.4,15.43 53.4,13.08 v52.96,12.64
LED1  (via drill 0.33)
  Top 0.152: H1.C 67.08,32.04 v68.14,31.11 | v50.61,25.97 50.61,23.94 50.23,23.56 47.78,23.56 D1.39
  Bottom 0.152: v68.14,31.11 67.18,30.16 55.94,30.16 55.05,31.05 54.29,31.05 53.59,30.35 53.59,28.7 52.51,27.62 51.69,27.62 50.93,26.86 50.93,26.29 v50.61,25.97
LED2  (via drill 0.33)
  Top 0.152: H2.C 67.06,30.48 v68.33,29.65 | v51.18,25.08 51.18,23.62 50.67,22.99 47.82,22.99 D1.40
  Bottom 0.152: v68.33,29.65 67.44,29.65 67.31,29.78 55.82,29.78 54.93,30.67 54.36,30.67 53.91,30.23 53.91,28.57 52.64,27.3 51.82,27.3 51.37,26.86 51.37,25.53 v51.18,25.08
LED3  (via drill 0.33)
  Top 0.152: 66.36,28.83 66.38,28.86 H3.C 66.41,28.96 67.25,28.96 67.56,28.64 v67.56,26.1 | D1.51 50.63,18.25 51.12,18.73 51.88,18.73 53.28,20.13 56.71,20.13 57.85,18.99 57.85,18.67 58.23,18.03 59.37,18.03 59.69,17.78 v59.69,16.57
  Bottom 0.152: v67.56,26.1 66.67,26.1 66.23,25.65 66.23,24.57 66.48,24.32 66.48,21.02 66.36,20.89 66.36,16.13 65.47,15.24 62.48,15.24 62.23,15.49 60.13,15.49 59.69,15.94 v59.69,16.57
LED4  (via drill 0.33)
  Top 0.152: D1.52 51.12,18.22 51.31,18.41 52.07,18.41 53.34,19.68 56.58,19.68 57.47,18.8 57.47,18.48 57.91,17.59 58.42,17.59 v59.05,17.4 | v67.06,25.21 66.42,25.84 66.42,27.34 H4.C
  Bottom 0.152: v67.06,25.21 66.86,25.02 66.86,24.07 66.8,24 66.8,16.13 65.53,14.86 60.33,14.86 59.05,16.13 v59.05,17.4
MISO1  (via drill 0.33)
  Top 0.152: v54.61,29.91 D1.22
  Bottom 0.152: X5.7 63.59,26.08 63.44,26.23 61.91,26.23 60.58,27.56 55.75,27.56 55.12,28.19 55.12,29.4 v54.61,29.91
MOSI1  (via drill 0.33)
  Top 0.152: v54.23,26.73 54.17,26.73 54.1,26.8 54.1,28.36 D1.23
  Bottom 0.152: X5.3 59.19,26.35 58.74,26.8 55.75,26.8 55.5,26.54 54.8,26.54 54.61,26.73 v54.23,26.73
N$1
  Top 0.305: N1.5 12.46,7.42 12.64,7.24 12.64,6.41 C1.1
  Top 0.381: V1.C 11.49,4.19 11.75,4.45 11.75,4.95 12,5.21 12.51,5.21 12.76,5.46 12.76,6.16 C1.1
N$2  (via drill 0.33)
  Top 0.305: X4.3 6.5,24.61 v6.99,23.75
  Bottom 0.152: v6.99,23.75 7.05,23.3 7.05,18.35 9.03,16.37 R17.2
N$3
  Top 0.305: N1.6 15.35,7.57 15.43,7.49 R2.1 16.45,7.46 R7.2
N$4  (via drill 0.33)
  Top 0.305: X4.2 7,25.26 v7.37,24.64
  Bottom 0.152: v7.37,24.64 7.68,24.07 7.68,23.56 7.37,23.05 7.37,18.48 8,17.84 9.09,17.84 R16.2
N$5
  Top 0.254: R34.2 39.55,22.34 E4.3
N$6
  Top 0.33: N1.2 11.37,9.53 11.11,9.78 11.11,11.05 10.35,11.81 L1.2
N$7
  Top 0.305: L2.2 C1.2 10.93,8.07 11.37,8.51 N1.4
N$8
  Top 0.152: N5.3 36.66,6.01 36.77,5.91 38.8,5.91 38.92,6.03 R15.2 38.89,6.86 38.16,6.86 37.91,7.11 37.91,9.02 37.59,9.34 36.51,9.34 36.01,9.84 N5.7
N$9
  Top 0.305: N1.7 17.17,8.51 R2.2
N$10
  Top 0.305: H1.A R11.2
N$11
  Top 0.305: N1.10 16.46,10.01 R6.2 R3.1
N$12  (via drill 0.33)
  Top 0.152: v57.59,21.4 57.98,21.02 58.98,21.02 D1.5
  Bottom 0.152: G1.1 64.69,17.67 64.07,18.29 63.31,18.29 63.18,18.41 60.57,18.41 C23.2 60.25,18.74 59.63,19.37 59.63,19.43 59.56,19.49 59.56,20.64 59.18,21.02 58.17,21.02 v57.59,21.4
N$13
  Top 0.305: H2.A 63.68,30.48 R12.2
N$14  (via drill 0.33)
  Top 0.152: v60.39,21.02 60.01,21.53 59,21.53 D1.6
  Bottom 0.152: G1.3 61.72,19.5 61.21,20 C24.2 60.31,20.5 60.45,20.64 60.45,21.02 v60.39,21.02
N$15
  Top 0.305: H3.A 63.67,28.93 R13.2
N$17
  Top 0.305: H4.A 63.67,27.38 R14.2
N$18
  Top 0.152: N5.6 36.66,9.94 36.83,9.78 38.91,9.78 R32.2 R15.1
N$20  (via drill 0.33)
  Top 0.152: N6.15 18.21,22.15 v18.48,22.42 | v32.83,36.64 66.04,36.64 66.42,36.32 66.42,34.1 66.48,33.59 66.46,33.59 H5.C
  Bottom 0.152: v18.48,22.42 21.91,22.42 24.48,24.99 24.77,25.27 24.77,30.1 27.94,33.27 28.57,33.27 30.8,35.5 31.69,35.5 v32.83,36.64
N$21
  Top 0.305: N6.19 18.37,24.54 C19.1
N$22
  Top 0.305: R25.1 63.67,33.64 H5.A
N$24
  Top 0.305: N6.2 R26.1
NSS1  (via drill 0.33)
  Top 0.152: v56.39,23.81 55.12,22.54 55.12,22.23 54.67,21.78 50.74,21.78 50.48,21.53 50.48,21.21 49.72,20.77 49.72,20.26 50.16,19.81 50.16,17.21 D1.50
  Bottom 0.152: 57.91,25.34 57.91,24.32 57.66,24.07 56.64,24.07 v56.39,23.81
  Bottom 0.254: X5.2 58.06,25.48 57.91,25.34
OE  (via drill 0.33)
  Top 0.152: X1.7 49.39,3.48 v49.21,3.3 | v54.04,23.56 55.24,23.56 57.72,26.04 D1.15
  Bottom 0.152: v49.21,3.3 49.21,11.24 52.2,14.22 52.2,18.54 53.78,20.13 53.78,23.3 v54.04,23.56
RESETN  (via drill 0.33)
  Top 0.152: D1.7 56.57,22.02 56.39,21.84 55.5,21.84 54.99,21.34 51.31,21.34 v50.42,20.45
  Top 0.254: R31.1 31.94,34.17 X6.1
  Bottom 0.152: v50.42,20.45 48.77,20.45 46.93,22.42 42.23,22.42 41.78,22.92 41.78,32.07 40.83,33.02 40.83,35.43 40.51,35.75 33.52,35.75 X6.1
RX1  (via drill 0.33)
  Top 0.152: v49.72,21.46 47.84,21.46 D1.43
  Bottom 0.152: X6.6 44.67,33.11 42.61,31.05 42.61,23.75 43.18,23.18 49.02,23.18 49.97,22.23 49.97,21.72 v49.72,21.46
SCK1  (via drill 0.33)
  Top 0.152: v55.12,27.11 55.12,28.38 D1.21
  Bottom 0.152: X5.5 61.38,26.25 60.45,27.18 55.18,27.18 v55.12,27.11
SCL  (via drill 0.33)
  Top 0.152: D2.2 34.41,17.27 33.02,15.88 22.8,15.88 20.13,18.54 20.13,27.05 19.56,27.62 16.64,27.62 15.79,26.77 N6.1 | D1.58 54.14,15.9 54.23,15.81 54.23,14.8 53.15,13.72 47.12,13.72 v46.93,13.91 | v37.27,18.1 37.59,17.84
  Top 0.254: D2.2 37.2,17.27 37.34,17.4 37.34,17.59 37.59,17.84 38.25,17.84 R27.2
  Bottom 0.152: v46.93,13.91 41.34,13.91 40.89,14.35 40.89,17.78 40.51,18.16 37.4,18.16 v37.27,18.1
SDA  (via drill 0.33)
  Top 0.152: 35.79,16.61 34.42,15.24 22.48,15.24 19.43,18.29 19.43,22.86 18.8,23.5 16.7,23.5 | D1.59 54.62,14.74 53.28,13.4 47.31,13.4 v46.93,13.02 | v38.29,15.3 38.29,16.31 R28.2
  Top 0.254: R28.2 37.27,16.32 36.98,16.61 D2.1 35.79,16.61 | 16.7,23.5 N6.17
  Bottom 0.152: v46.93,13.02 40.58,13.02 v38.29,15.3
SPH  (via drill 0.33)
  Top 0.152: X1.11 50.59,4.74 v49.97,4.13 | v54.36,22.54 54.04,22.54 53.4,23.18 53.4,23.81 53.78,24.19 54.61,24.19 54.8,24 55.12,24 55.44,24.32 55.5,24.32 57.72,26.54 D1.16
  Bottom 0.152: v49.97,4.13 49.97,8.64 50.35,9.02 50.35,10.03 50.1,10.29 50.1,11.62 52.7,14.22 52.7,18.61 54.17,20.07 54.17,22.35 v54.36,22.54
SPV/BOOT1  (via drill 0.33)
  Top 0.152: X1.37 58.39,4.67 58.48,4.57 | 58.48,4.57 60.01,4.57 61.15,6.1 63.77,6.1 R19.2 | X1.32 56.89,9.28 v56.77,9.4 | v58.55,4.06 58.55,4.51 58.48,4.57 | v54.86,24.77 53.28,24.77 53.09,24.51 52.26,24.51 52.13,24.64 52.13,25.59 51.5,26.23 51.5,27.05 51.63,27.18 D1.28
  Bottom 0.152: v58.55,4.06 57.98,4.64 57.21,4.64 56.77,5.08 v56.77,9.4 56.77,17.27 55.5,18.54 55.5,24.13 v54.86,24.77
SWCLK  (via drill 0.33)
  Top 0.152: D1.49 49.62,19.15 v49.47,19.43
  Bottom 0.152: v49.47,19.43 49.4,19.62 43.5,19.62 43.31,19.43 42.48,19.43 41.27,20.64 41.27,30.73 39.56,32.45 39.56,34.18 X6.4
SWDIO  (via drill 0.33)
  Top 0.152: v46.86,18.16 46.55,18.48 46.55,19.68 46.86,20 47.73,20 D1.46
  Bottom 0.152: X6.2 34.51,22.9 35.24,22.16 38.61,22.16 42.16,18.61 46.42,18.61 v46.86,18.16
TB1
  Top 0.305: R21.2 67.14,16.61 67.5,16.26 X10.2
TB2
  Top 0.305: R22.2 66.98,18.21 67.56,18.8 X10.3
TB3
  Top 0.305: R23.2 67.25,19.68 67.63,20.07 67.63,21.02 67.94,21.34 X10.4
TBSHIELD
  Top 0.305: R24.1 67.2,15.1 67.63,14.67 67.63,14.1 68.01,13.72 X10.1
  pour Top (isolate 0.152): 65.98,14.41 65.98,21.97 66.74,22.73 69.6,22.73 70.29,22.03 70.29,13.08 69.6,12.38 68.39,12.38 66.8,13.97 66.42,13.97
TX1  (via drill 0.33)
  Top 0.152: v49.21,22.16 49.21,22.1 49.09,21.97 47.82,21.97 D1.42
  Bottom 0.152: X6.5 42.13,23.47 42.74,22.8 48.64,22.8 v49.21,22.16
USBDM  (via drill 0.33)
  Top 0.152: D1.44 46.79,21.03 v46.42,21.4 | v42.67,21.08 42.67,20.95 42.48,20.77 42.48,20.64 40.96,19.11 37.53,19.11 36.7,19.94 36.13,19.94 v35.88,20.19
  Bottom 0.152: v46.42,21.4 46.35,21.4 45.72,20.77 42.86,20.77 42.67,20.95 v42.67,21.08 | v35.88,20.19 35.69,20 35.24,20 35.12,20.13 34.67,20.13 34.29,19.75 34.29,18.61 31.3,15.62 13.14,15.62 11.49,17.27 11.49,17.72 11.37,17.84 10.62,17.84 R16.1
USBDP  (via drill 0.33)
  Top 0.152: D1.45 46.49,20.52 v46.42,20.45 | v42.8,20.13 42.55,20.26 41.08,18.8 37.34,18.8 36.51,19.62 35.05,19.62 v34.92,19.49
  Bottom 0.152: v46.42,20.45 43.12,20.45 v42.8,20.13 | v34.92,19.49 34.92,18.8 31.43,15.3 12.95,15.3 11.87,16.38 10.59,16.38 R17.1
USD_DETN  (via drill 0.33)
  Top 0.152: v46.42,24.45 46.42,22.8 46.74,22.48 47.71,22.48 D1.41
  Bottom 0.152: X5.10B X5.10 49.03,35.38 47.62,33.97 47.62,25.53 v46.42,24.45
VBATT  (via drill 0.33)
  Top 0.152: 14.57,27.24 14.57,29.02
  Top 0.305: N6.4 14.29,26.92 14.57,27.24 | 14.57,29.02 14.57,30.06 15.11,30.61 15.11,32.58 15.68,33.15 17.07,33.15 X7.1
  Top 0.508: C21.1 14.83,19.53 v14.35,19.05 | SJ2.1 18.09,34.16 X7.1
  Bottom 0.508: v14.35,19.05 14.29,19.05 13.91,19.43 10.16,19.43 8.64,20.95 8.64,28.51 9.78,29.65 10.73,29.65 11.05,29.97 11.05,34.67 12,35.62 14.35,35.62 15.81,34.16 18.09,34.16 X7.1
  pour Top (no thermals): 14.22,19.81 14.22,22.42 15.37,22.42 15.37,19.75 14.29,19.75
VEINK
  Top 0.305: 5.02,11.56 5.3,11.56 L1.1 5.52,11.84 5.52,12.95 6.16,13.59 6.16,13.72 6.92,14.48 9.84,14.48 10.67,13.65 C2.1
  Top 0.33: 5.27,9.02 5.02,9.02 | 5.02,9.02 4.76,8.76 4.76,6.73 5.02,6.48 L2.1 | 5.02,11.56 4.76,11.3 4.76,9.27 5.02,9.02
  Top 0.381: N1.3 5.27,9.02
  Top 0.406: 5.27,9.02 2.79,9.02 V4.3
VEINK1
  Top 0.305: E4.2 30.36,22.45 V5.3
VEINK33  (via drill 0.33)
  Top 0.152: X1.30 56.26,8.31 56.26,8.95 56.07,9.14 56.07,9.65 56.64,10.22 58.29,10.22 | X1.4 48.49,10 48.45,10.03 v48.26,10.16 | v54.55,3.56 57.53,3.56 57.85,3.87 57.85,5.35 X1.35 57.79,6.29 57.98,6.48 58.74,6.48 59.18,6.92 59.18,8.76 60.01,9.59 60.01,10.29 58.67,10.29 58.61,10.22 58.29,10.22 | 62.37,12.26 C7.1 62.3,12.32 | X1.36 58.09,9.06 58.29,9.27 58.29,10.22
  Top 0.254: V3.3 62.37,12.26 | 60.01,10.29 60.01,10.99 61.34,12.32 62.3,12.32
  Bottom 0.152: v48.26,10.16 48.26,7.68 48.07,7.49 48.07,4.45 47.43,3.81 46.74,3.81 46.35,3.43 46.35,2.54 46.93,1.97 52.51,1.97 53.15,1.4 53.72,1.4 54.17,1.78 54.17,3.17 v54.55,3.56
VEINK_CTRLN  (via drill 0.33)
  Top 0.152: D1.54 52.13,16.13 50.8,14.8 v50.8,14.29 | v42.1,11.62 42.1,8.83 41.47,8.19 41.47,5.91 v41.59,5.78 | v36.01,1.65 35.88,1.65 35.18,0.95 25.59,0.95 24.96,1.59 20.38,1.59 19.62,0.89 12.51,0.89 10.92,2.48 6.41,2.48 3.43,5.46 3.43,6.67 2.35,7.75 2.16,7.75 1.78,8.13 1.78,9.72 2.16,10.1 2.64,10.1 V4.1
  Top 0.406: V4.1 3.75,12.06 3.56,12.26 3.56,12.8 R1.1
  Bottom 0.152: v50.8,14.29 49.53,12.95 48.39,11.81 48.39,11.37 48.2,11.18 47.05,11.18 46.86,11.37 42.61,11.37 42.35,11.62 v42.1,11.62 | v41.59,5.78 41.59,2.35 40.7,1.46 36.2,1.46 v36.01,1.65
VEINKVCOM  (via drill 0.33)
  Top 0.152: X1.22 53.89,9.75 v54.23,10.1
  Top 0.254: v56.2,1.65 55.44,0.89 43.56,0.89 41.02,3.43 41.02,4.95 40.7,5.27 36.01,5.27
  Top 0.305: N5.1 35.37,5.59 35.69,5.27 36.01,5.27 N5.2
  Bottom 0.152: v54.23,10.1 54.23,4.89 54.61,4.51 54.61,4.45 56.2,2.79 v56.2,1.65
VNEG15  (via drill 0.33)
  Top 0.152: X1.1 47.59,6.07 46.99,6.67 v46.35,6.67 | v38.35,4.38 37.97,4.76 35.74,4.76 35.52,4.55
  Top 0.305: X2.2 31.88,5.97 33.85,7.94 34.73,7.94 | 34.73,7.94 37.15,7.94 37.27,7.81 37.27,6.95 N5.4 | R9.2 35.52,4.55 34.73,5.33 34.73,7.94
  Top 0.381: N3.1 26.99,3.81 27.11,3.94 C4.1 27.18,4.7 28.38,4.7 29.4,5.71 X2.2
  Bottom 0.152: v46.35,6.67 40.64,6.67 v38.35,4.38
VNEG20  (via drill 0.33)
  Top 0.152: X1.24 54.49,8.96 v55.05,9.53
  Top 0.33: N3.2 N3.3 | N3.7 N3.6
  Top 0.381: X2.1 28.38,3.43 27.75,2.79 23.43,2.79 22.8,3.43 22.8,5.08 | 22.8,5.08 N3.2 | 22.8,5.08 N3.7 18.48,5.08 17.72,4.32 16.54,4.32 R7.1 14.77,4.23 C5.1 12.91,4.13 V1.A
  Bottom 0.152: v55.05,9.53 55.05,4.51 56.96,2.6 56.96,1.33 56.33,0.7 34.23,0.7 31.56,3.37 29.46,3.37 X2.1
VNEG_CTRLN  (via drill 0.33)
  Top 0.152: N1.8 15.68,9.02 15.81,8.89 17.97,8.89 v18.22,8.64 | D1.38 49.05,24.03 v49.15,24.13 | v15.56,14.61 15.56,15.3 16,15.75 16,16 16.57,16.57 17.97,16.57 v18.86,17.46 | v20.83,19.05 20.83,21.91 26.92,28 v27.11,28 | v31.37,28.32 32.07,27.62 32.07,26.35 32.51,25.91 33.72,25.91 33.78,25.97 38.42,25.97 38.92,26.48 v43.37,26.48 44.39,26.48 45.28,27.37 45.28,27.81 45.53,28.07 46.8,28.07 46.93,28.19 46.93,29.65 46.61,29.97 46.61,30.76 R4.2
  Bottom 0.152: v49.15,24.13 49.02,24 47.94,24 47.43,23.5 43.94,23.5 43.12,24.32 43.12,26.23 v43.37,26.48 | v18.22,8.64 18.22,11.94 v15.56,14.61 | v18.86,17.46 19.24,17.46 v20.83,19.05 | v31.37,28.32 27.43,28.32 v27.11,28
VPOS15  (via drill 0.33)
  Top 0.152: X1.2 47.89,9.64 v47.31,10.22 | v39.88,12.7 35.88,12.7 35.37,12.19
  Top 0.305: N5.8 35.37,12.19 34.99,12.57 | 34.99,12.57 29.91,12.57 29.4,13.08 | R8.2 35.34,13.63 34.99,13.27 34.99,12.57
  Top 0.381: N2.1 26.16,10.41 C3.1 28.19,12.45 28.77,12.45 29.4,13.08 X2.5
  Bottom 0.152: v47.31,10.22 46.61,10.92 41.66,10.92 v39.88,12.7
VPOS22  (via drill 0.33)
  Top 0.152: X1.23 54.19,4.66 53.78,4.25 53.78,3.11 54.1,2.79 55.05,2.79 v55.44,2.41
  Top 0.305: N1.1 11.9,10.01 11.62,10.29 11.62,12.7 14.67,12.7 C6.1 | C6.1 14.92,13.84 | 14.86,13.46 C6.1 | N2.8 19.82,10.46 20.26,10.54 19.24,10.54 | 17.97,12.28 R3.2
  Top 0.381: R3.2 17.93,13.12 17.59,13.46 14.86,13.46 | 19.24,10.54 18.48,11.18 18.22,11.18 17.97,11.43 17.97,12.28 | X2.4 28.77,11.05 27.24,9.53 22.67,9.53 21.78,10.41 N2.8
  Bottom 0.152: v55.44,2.41 55.44,1.46 55.05,1.08 34.61,1.08 30.99,4.7 30.99,9.46 X2.4
VPOS_CTRLN  (via drill 0.33)
  Top 0.152: N1.9 15.81,9.53 16.07,9.27 18.61,9.27 v19.37,8.64 | D1.37 48.67,24.54 48.83,24.7 48.83,25.21 v49.02,25.4 | v16.51,14.54 16.51,15.88 16.83,16.19 18.54,16.19 v18.86,16.51 | v21.46,18.48 21.46,22.1 25.27,25.91 26.16,25.91 v27.18,26.92 | v33.34,26.48 38.16,26.48 38.86,27.18 v44.2,27.18 44.2,27.43 44.26,27.5 44.26,28.19 44.01,28.45 43.62,28.45 43.5,28.57 43.5,29.18 R5.2
  Bottom 0.152: v49.02,25.4 49.02,24.96 48.64,24.57 47.5,24.57 46.8,23.81 44.32,23.81 43.75,24.38 43.75,25.78 44.2,26.23 v44.2,27.18 | v19.37,8.64 19.37,11.68 v16.51,14.54 | v18.86,16.51 19.05,16.51 20.57,18.03 20.95,18.03 v21.46,18.48 | v27.18,26.92 32.89,26.92 v33.34,26.48
VSYS  (via drill 0.33)
  Top 0.305: C14.1 26.39,18.46 26.23,18.29 N4.3 | R26.2 13.86,30.49 14.16,30.8 14.16,33.91 13.91,34.16 13.07,34.16
  Top 0.406: V4.2 1.84,11.81 2.1,12.06 2.1,12.79 R1.2 2.13,14.32 5.02,17.21 17.34,17.21 17.91,17.78 17.91,19.81 17.84,19.88 v17.84,20.57 | v23.11,18.29 N4.3
  Top 0.508: v9.46,23.37 10.92,23.37 C20.1 | SJ2.2 13.07,34.16 X8.1 12.99,34.16 SJ1.2
  Bottom 0.406: v12.7,22.23 16.95,22.23 17.84,21.34 | 17.84,21.34 20.07,21.34 v23.11,18.29 | 17.84,21.34 v17.84,20.57
  Bottom 0.508: X8.1 12.17,34.2 11.81,33.91 11.81,29.34 11.43,28.89 10.1,28.89 9.4,28.19 9.4,23.43 v9.46,23.37
  pour Top (no thermals): 8.83,23.75 11.75,23.75 11.87,23.62 13.08,23.62 13.08,22.61 13.27,22.42 13.91,22.42 13.91,21.65 12.83,21.65 11.87,22.61 9.59,22.61 8.83,23.24
VUSB
  Top 0.152: 5.97,26.73 5.97,26.31 X4.1
  Top 0.508: SJ1.1 7.99,34.16 X9.1
  Top 1.27: X9.1 6.77,34.2 5.97,33.4 5.97,26.73
  pour Top (no thermals): 3.56,25.78 3.56,26.1 5.33,26.8 8.38,26.8 9.78,25.4 12.89,25.4 13.08,25.21 13.08,23.94 12.13,23.94 11.87,24.13 9.46,24.13 7.87,25.72

### Text on the board
Top: EINK | KL 2013
tPlace: BATT | VUSB | VSYS | BOOT | DEBUG | MICROSD(SPI) | + | + | Chg | RST | IO | GND | CK | TX | RX | Flip | Act | Run | Dbg | 3 | USB | 2 | 1 | +15V | S | +22V | GND | -15V | -20V | PANEL
bPlace: eInk Display Controller / V1.0 KL 13.9.2013
tStop: EINK | KL 2013